# EasyEDA Pro project 游戏机_2026-06-01_v1.0.2.epro

# Schematic M0底板demo
Board Name: 地猛星M0底板demo; Create Date: 2025-10-09; Page Name: P1; Project Name: M0扩展-排母; Schematic Name: M0底板demo; Update Date: 2025-10-16; Company: 嘉立创EDA; Page Size: A4; Version: V1.0
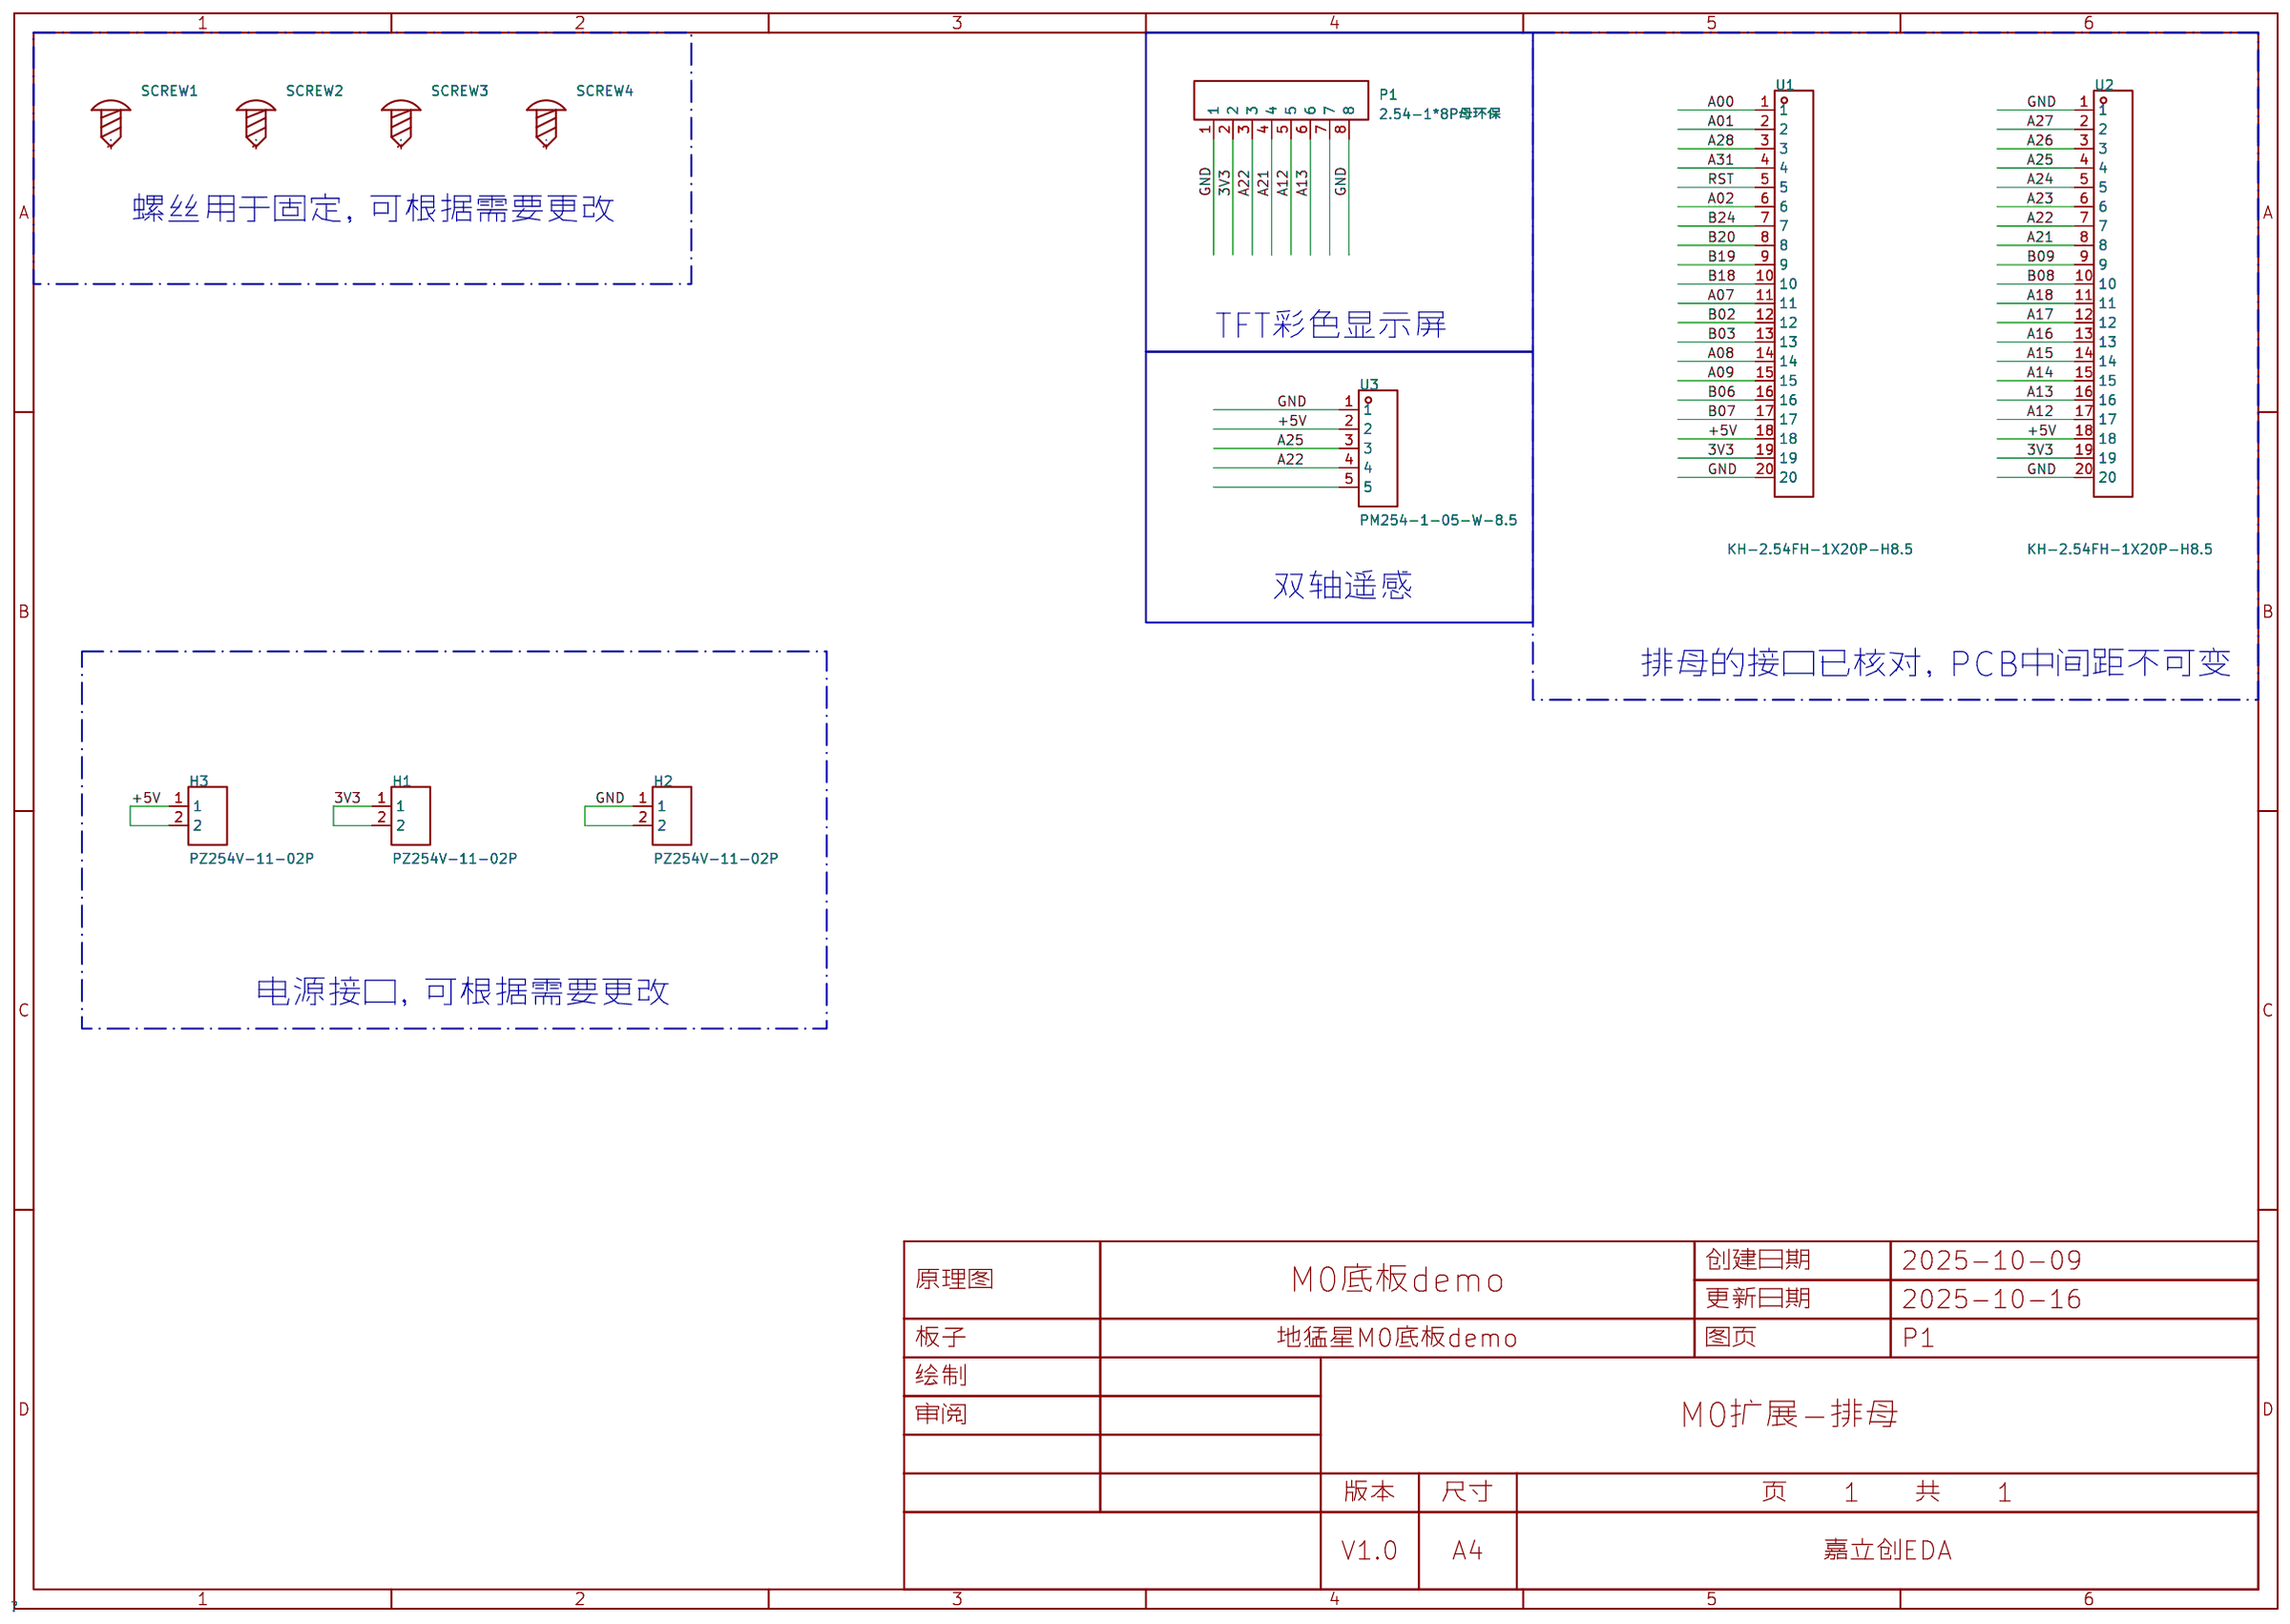
[diagram p0: schematic sheet]

## Parts
H1  PZ254V-11-02P  [HDR-TH_2P-P2.54-V-M]
H2  PZ254V-11-02P  [HDR-TH_2P-P2.54-V-M]
H3  PZ254V-11-02P  [HDR-TH_2P-P2.54-V-M]
P1  2.54-1*8P母环保  [HDR-TH_8P-P2.54-V-F]
SCREW1  -  [M3螺丝]
SCREW2  -  [M3螺丝]
SCREW3  -  [M3螺丝]
SCREW4  -  [M3螺丝]
U1  KH-2.54FH-1X20P-H8.5  [HDR-TH_20P-P2.54-V-F-2]
U2  KH-2.54FH-1X20P-H8.5  [HDR-TH_20P-P2.54-V-F-2]
U3  PM254-1-05-W-8.5  [HDR-TH_5P-P2.54-H-F-W10.0-N]

## Library data of the parts
H1-H3 = PZ254V-11-02P: 插针结构:1x2P;间距:2.54mm;行距:-;圆针/方针:方针;安装方式:直插;排数:单排;总PIN位数:2P;额定电流:-;额定电压:-;配合针长度:6mm;塑高:2.5mm;端接针长度:3mm;触头材质:黄铜;触头镀层:-;工作温度:-40℃~+105℃;颜色:黑色;; LCSC Part Name: 1x2P 间距:2.54mm 方针 直插; Supplier Part: C492401; Manufacturer: XFCN(兴飞); Supplier Footprint: 插件,P=2.54mm; JLCPCB Part Class: 扩展库; Datasheet: https://item.szlcsc.com/datasheet/PZ254V-11-02P/502957.html; Supplier: LCSC; Pin Structure: 1x2P; Pitch: 2.54mm; Circluar Pins/Square Pins: 方针; Mounting Type: 直插; Number of Rows: 单排; Number of Pins: 2P; Length of Mating Pin: 6mm; Insulation Height: 2.5mm; Length of End Connection Pin: 3mm; Contact Material: 黄铜; Operating Temperature: -40℃~+105℃; Color: 黑色
P1 = 2.54-1*8P母环保: 插孔结构:1x8P;间距:2.54mm;行距:-;圆孔/方孔:方孔;安装方式:直插;排数:单排;总孔位数:8P;额定电流:3A;插孔方向:顶部;塑高:8.5mm;触头材质:黄铜;触头镀层:金;工作温度:-55℃~+105℃;; LCSC Part Name: 1x8P 间距:2.54mm 直插; Supplier Part: C27438; Manufacturer: BOOMELE(博穆精密); Supplier Footprint: 插件,P=2.54mm; JLCPCB Part Class: Extended Part; Datasheet: https://item.szlcsc.com/datasheet/2.54-1*8P%25E6%25AF%258D%25E7%258E%25AF%25E4%25BF%259D/28187.html; Supplier: LCSC; Holes Structure: 1x8P; Pitch: 2.54mm; Circular Hole / Square Hole: 方孔; Mounting Type: 直插; Number of Rows: 单排; Number of Positions: 8P; Current Rating: 3A; Holes Direction: 顶部; Insulation Height: 8.5mm; Contact Material: 黄铜; Contact Plating: 金; Operating Temperature: -55℃~+105℃; PIN Length: 3.2mm
SCREW1-SCREW4 = M3螺丝: Supplier Footprint: 插件
U1 U2 = KH-2.54FH-1X20P-H8.5: 插孔结构:1x20P;间距:2.54mm;行距:-;圆孔/方孔:方孔;安装方式:直插;排数:单排;总孔位数:20P;额定电流:3A;额定电压:-;插孔方向:顶部;塑高:8.5mm;工作温度:-40℃~+105℃;; LCSC Part Name: 间距:2.54mm 1x20P 直插; Supplier Part: C2905423; Manufacturer: kinghelm(金航标); Supplier Footprint: 插件,P=2.54mm; JLCPCB Part Class: 扩展库; Datasheet: https://item.szlcsc.com/datasheet/KH-2.54FH-1X20P-H8.5/3175197.html; Supplier: LCSC; Holes Structure: 1x20P; Pitch: 2.54mm; Circular Hole / Square Hole: 方孔; Mounting Type: 直插; Number of Rows: 单排; Number of Positions: 20P; Current Rating: 3A; Holes Direction: 顶部; Insulation Height: 8.5mm; Operating Temperature: -40℃~+105℃
U3 = PM254-1-05-W-8.5: 插孔结构:1x5P;间距:2.54mm;行距:-;圆孔/方孔:方孔;安装方式:弯插;排数:单排;总孔位数:5P;额定电流:3A;额定电压:-;插孔方向:侧面;塑高:8.5mm;触头材质:铜合金;工作温度:-40℃~+105℃;; LCSC Part Name: 1x5P 间距:2.54mm 弯插; Supplier Part: C2897387; Manufacturer: HCTL(华灿天禄); Supplier Footprint: 弯插,P=2.54mm; JLCPCB Part Class: Extended Part; Datasheet: https://item.szlcsc.com/datasheet/PM254-1-05-W-8.5/3142392.html; Supplier: LCSC; Holes Structure: 1x5P; Pitch: 2.54mm; Circular Hole / Square Hole: 方孔; Mounting Type: 弯插; Number of Rows: 单排; Number of Positions: 5P; Current Rating: 3A; Holes Direction: 侧面; Insulation Height: 8.5mm; Contact Material: 铜合金; Operating Temperature: -40℃~+105℃

## Nets
3V3: H1.1 H1.2 P1.2 U1.19 U2.19
+5V: H3.1 H3.2 U1.18 U2.18 U3.2
GND: H2.1 H2.2 P1.1 P1.8 U1.20 U2.1 U2.20 U3.1
A00: U1.1
A01: U1.2
A02: U1.6
A07: U1.11
A08: U1.14
A09: U1.15
A12: P1.5 U2.17
A13: P1.6 U2.16
A14: U2.15
A15: U2.14
A16: U2.13
A17: U2.12
A18: U2.11
A21: P1.4 U2.8
A22: P1.3 U2.7 U3.4
A23: U2.6
A24: U2.5
A25: U2.4 U3.3
A26: U2.3
A27: U2.2
A28: U1.3
A31: U1.4
B02: U1.12
B03: U1.13
B06: U1.16
B07: U1.17
B08: U2.10
B09: U2.9
B18: U1.10
B19: U1.9
B20: U1.8
B24: U1.7
RST: U1.5

Not connected (* = marked no-connect by the designer): P1 7; SCREW1 1; SCREW2 1; SCREW3 1; SCREW4 1; U3 5

## Notes on the sheet
- 螺丝用于固定，可根据需要更改
- TFT彩色显示屏
- 双轴遥感
- 排母的接口已核对，PCB中间距不可变
- 电源接口，可根据需要更改

# Board PCB1
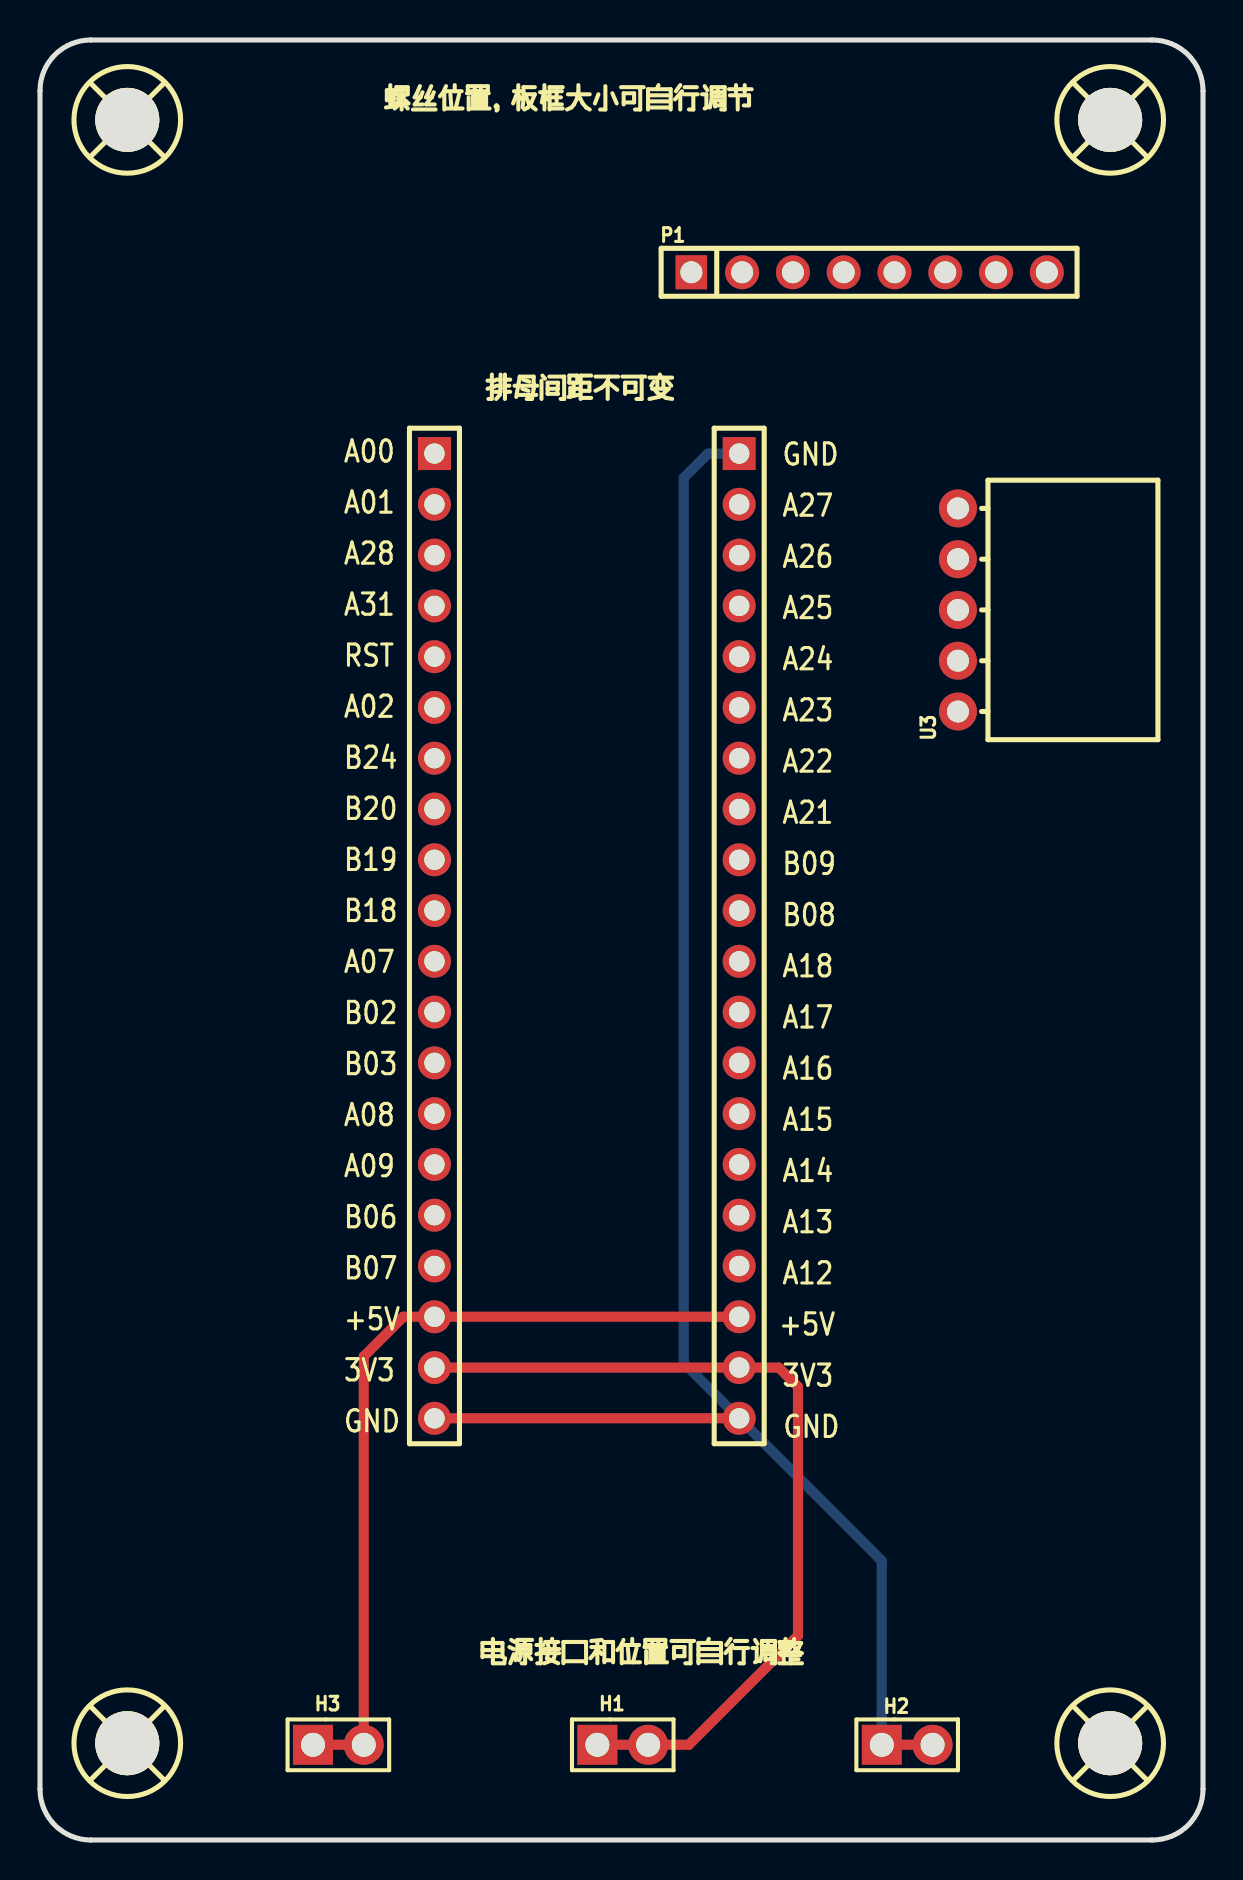
[diagram p1: board, top side]
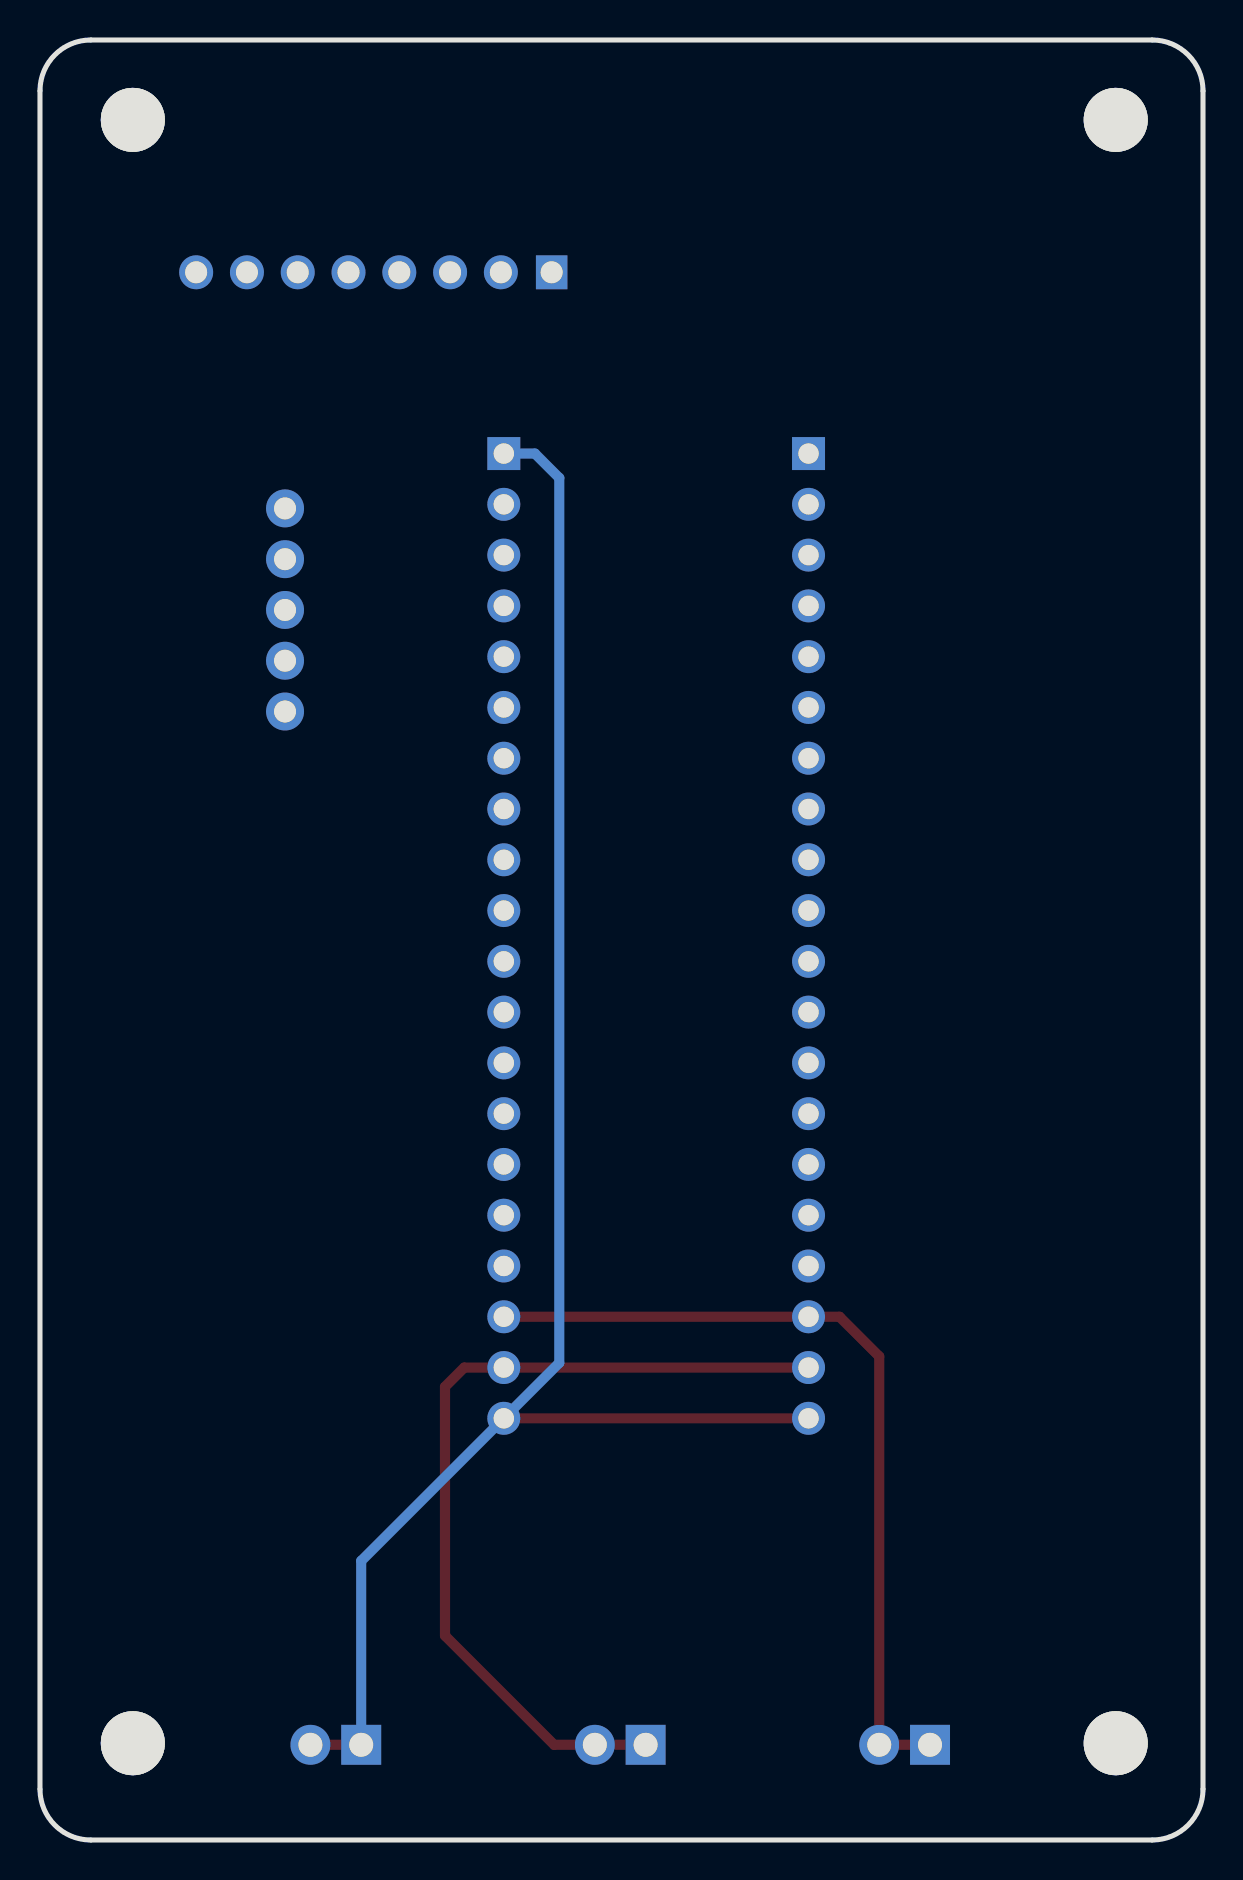
[diagram p2: board, bottom side, seen from below]

Outline 58.17 x 90.04 mm; copper layers: Top Layer, Bottom Layer. Coordinates in mm from the lower left corner of the outline.
Outline path: 0,87.5 arc(0.74,89.3) 2.54,90.04 55.63,90.04 arc(57.42,89.3) 58.17,87.5 58.17,2.54 arc(57.42,0.74) 55.63,0 2.54,0 arc(0.74,0.74) 0,2.54 0,87.5
Stack: Top Layer 0.035mm / Dielectric1 1.51mm FR4 er 4.5 / Bottom Layer 0.035mm

## Design rules (mm)
spacing copperThickness1oz (default): track to track 0.102, other pairs 0.152 to 0.3
spacing copperThickness2oz: track to track 0.203, other pairs 0.152 to 0.3
spacing Plane_innerPlane: track to track 0.102, other pairs 0.152 to 0.3
spacing Copper_copperRegion: track to track 0.102, other pairs 0.152 to 0.3
track width copperThickness1oz (default): min 0.127, default 0.254, max 2.54
track width copperThickness2oz: min 0.203, default 0.254, max 2.54
differential pair differentialPair (default): width min 0.127, default 0.254, max 2.54; gap min 0.152, default 0.152

## Placement (name value [footprint] x y rotation side)
H1  PZ254V-11-02P  [HDR-TH_2P-P2.54-V-M]  29.15 4.76 0 top
H2  PZ254V-11-02P  [HDR-TH_2P-P2.54-V-M]  43.37 4.76 0 top
H3  PZ254V-11-02P  [HDR-TH_2P-P2.54-V-M]  14.92 4.76 0 top
P1  2.54-1*8P母环保  [HDR-TH_8P-P2.54-V-F]  41.47 78.42 0 top
SCREW1  -  [M3螺丝]  4.37 86.05 0 top
SCREW2  -  [M3螺丝]  53.52 86.05 0 top
SCREW3  -  [M3螺丝]  4.37 4.84 0 top
SCREW4  -  [M3螺丝]  53.52 4.84 0 top
U1  KH-2.54FH-1X20P-H8.5  [HDR-TH_20P-P2.54-V-F-2]  19.73 45.22 270 top
U2  KH-2.54FH-1X20P-H8.5  [HDR-TH_20P-P2.54-V-F-2]  34.97 45.22 270 top
U3  PM254-1-05-W-8.5  [HDR-TH_5P-P2.54-H-F-W10.0-N]  45.91 61.53 90 top

## Footprints (pads in the part's own frame, mm; a bottom-side part is the same pattern mirrored in y, then rotated)
HDR-TH_2P-P2.54-V-M
  rect 2x2 hole 1.2: 1(-1.27,0)
  round 2 hole 1.2: 2(1.27,0)
HDR-TH_5P-P2.54-H-F-W10.0-N
  round 1.9 hole 1.1: 1(-5.08,0) 2(-2.54,0) 3(0,0) 4(2.54,0) 5(5.08,0)
HDR-TH_8P-P2.54-V-F
  rect 1.575x1.7 hole 1.1: 1(-8.89,0)
  round 1.7 hole 1.1: 2(-6.35,0) 3(-3.81,0) 4(-1.27,0) 5(1.27,0) 6(3.81,0) 7(6.35,0) 8(8.89,0)
HDR-TH_20P-P2.54-V-F-2
  rect 1.65x1.65 hole 1.02: 1(-24.13,0)
  round 1.65 hole 1.02: 2(-21.59,0) 3(-19.05,0) 4(-16.51,0) 5(-13.97,0) 6(-11.43,0) 7(-8.89,0) 8(-6.35,0) 9(-3.81,0) 10(-1.27,0) 11(1.27,0) 12(3.81,0) 13(6.35,0) 14(8.89,0) 15(11.43,0) 16(13.97,0) 17(16.51,0) 18(19.05,0) 19(21.59,0) 20(24.13,0)
M3螺丝
  round 3.2 hole 3.2: 1(0,0)

## Nets
As in the schematic.

Pads without a net: SCREW1 1; SCREW2 1; SCREW3 1; SCREW4 1

## Routing (per net, layer and track width the routed paths; a pad name or vN(x,y) marks a point on that pad's centre or on a via; arc(x,y) is an arc through that point)
3V3: length 43.3
  Top Layer w0.508: H1.1 H1.2 32.45,4.76 37.91,10.22 37.91,22.67 36.94,23.63 U2.19 U1.19
+5V: length 41.6
  Top Layer w0.508: H3.1 H3.2 16.19,24.19 18.17,26.17 U1.18 U2.18
GND: length 88.5
  Top Layer w0.508: U1.20 U2.20 ; H2.1 H2.2
  Bottom Layer w0.508: H2.1 42.1,13.96 U2.20 32.19,23.87 32.19,68.14 33.41,69.35 U2.1

## Text on the board
Top Silkscreen Layer: A00 | A01 | A28 | A31 | RST | A02 | B24 | B20 | B19 | B18 | A07 | B02 | B03 | A08 | A09 | B06 | B07 | +5V | 3V3 | GND | A27 | A26 | A25 | A24 | A23 | A22 | A21 | B09 | B08 | A18 | A17 | A16 | A15 | A14 | A13 | A12 | 螺丝位置，板框大小可自行调节 | 电源接口和位置可自行调整 | 排母间距不可变
